# EAGLE design pmon_20v (EAGLE 6.5.0)
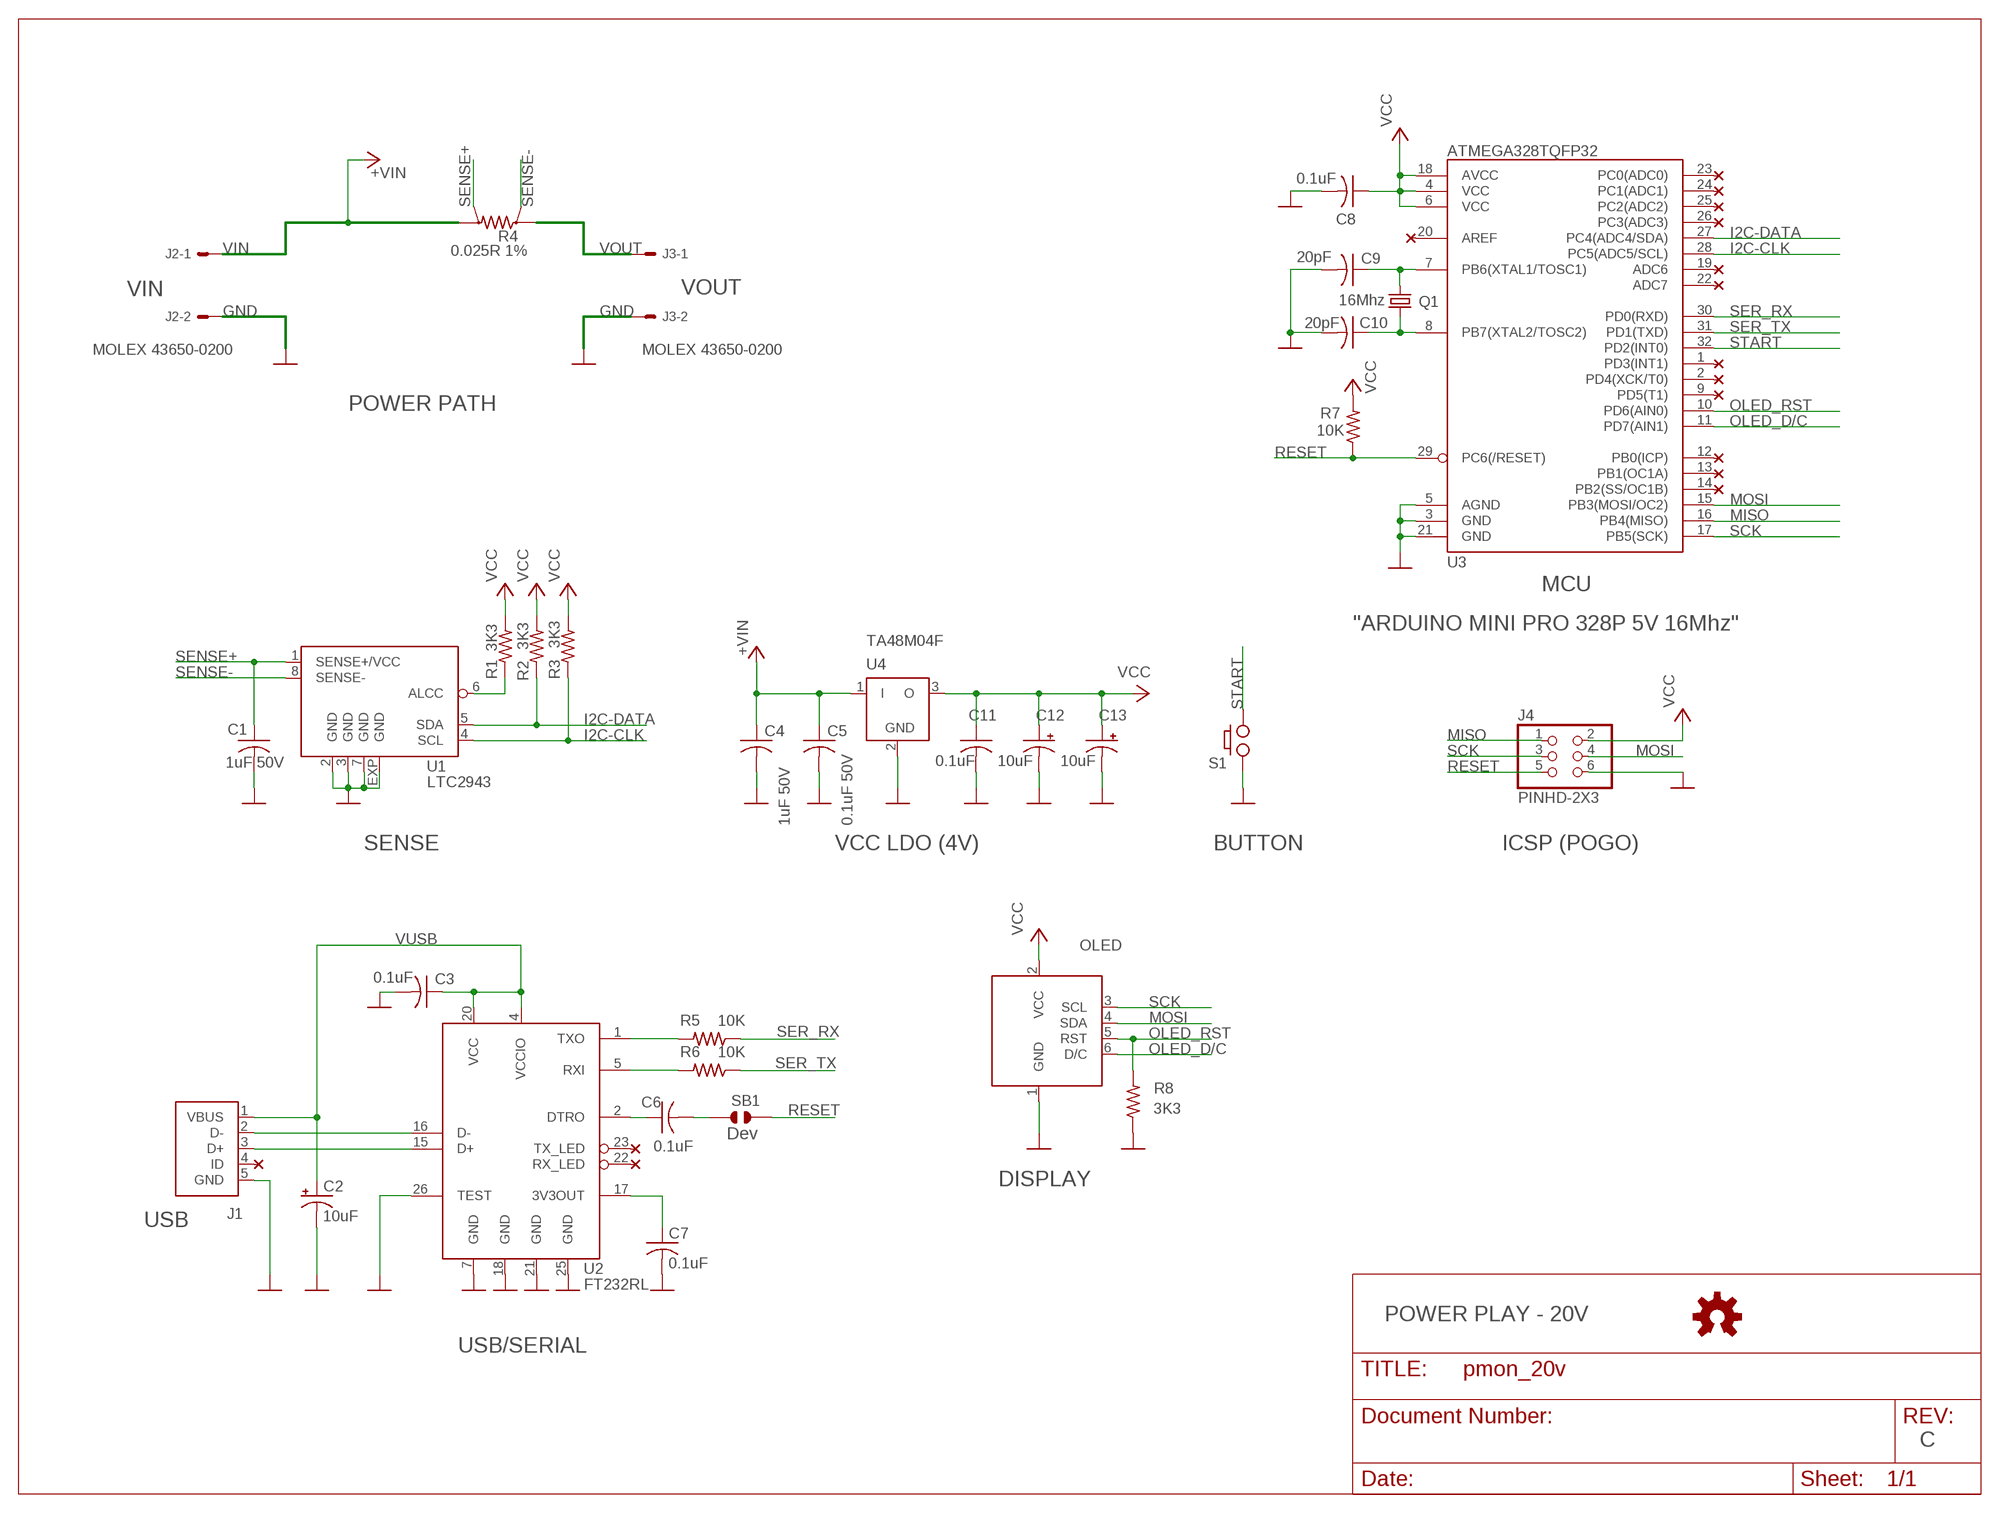
[diagram p0: schematic, sheet 1]

## Parts
C1  1uF 50V  CAP-C0603  [C0603]
C2  10uF  CPOL-USA/3216-18R  [A/3216-18R]
C3  0.1uF  CAP-C0603  [C0603]
C4  1uF 50V  CAP-C0603  [C0603]
C5  0.1uF 50V  CAP-C0603  [C0603]
C6  0.1uF  CAP-C0603  [C0603]
C7  0.1uF  CAP-C0603  [C0603]
C8  0.1uF  CAP-C0603  [C0603]
C9  20pF  CAP-C0603  [C0603]
C10  20pF  CAP-C0603  [C0603]
C11  0.1uF  CAP-C0603  [C0603]
C12  10uF  CPOL-USA/3216-18R  [A/3216-18R]
C13  10uF  CPOL-USA/3216-18R  [A/3216-18R]
J1  USB  [USB-MICRO-ZX62RD-AB-5P8]
J2  MOLEX 43650-0200  POWER_CON27-2021  [POWER_CON]
J3  MOLEX 43650-0200  POWER_CON27-2021  [POWER_CON]
J4  PINHD-2X3  [2X03]
OLED  OLED  [OLED]
Q1  16Mhz  CRYSTALCTS406  [CRYSTAL-CTS406]
R1  3K3  RES-R0603  [R0603]
R2  3K3  RES-R0603  [R0603]
R3  3K3  RES-R0603  [R0603]
R4  0.025R 1%  RES-SHUNT-6432  [KELVIN-6432]
R5  10K  RES-R0603  [R0603]
R6  10K  RES-R0603  [R0603]
R7  10K  RES-R0603  [R0603]
R8  3K3  RES-R0603  [R0603]
S1  PUSH_BUTTON  [TLE1105]
SB1  JUMPER_SOLDER_1X2  [JUMPER_SOLDER_1X2]
U1  LTC2943  [DFN8-3X3]
U2  FT232RL  [SSOP28DB]
U3  ATMEGA328TQFP32  [TQFP32-08]
U4  TA48M04F  LP2950  [DPACK]
U$28  OSH  [OSH]

## Nets
GND: C1.2 C2.- C3.2 C4.2 C5.2 C7.2 C8.2 C9.2 C10.2 C11.2 C12.- C13.- J1.5(GND) J2.2 J3.2 J4.6 OLED.1(GND) R8.1 S1.A U1.2(GND) U1.3(GND) U1.7(GND) U1.EXP(GND) U2.7(GND) U2.18(GND) U2.21(GND) U2.25(GND) U2.26(TEST) U3.3(GND) U3.5(AGND) U3.21(GND) U4.2(GND)
I2C-CLK: R3.1 U1.4(SCL) U3.28(PC5(ADC5/SCL))
I2C-DATA: R2.1 U1.5(SDA) U3.27(PC4(ADC4/SDA))
MISO: J4.1 U3.16(PB4(MISO))
MOSI: J4.4 OLED.4(SDA) U3.15(PB3(MOSI/OC2))
N$1: R1.1 U1.6(ALCC)
N$2: C9.1 Q1.1 U3.7(PB6(XTAL1/TOSC1))
N$6: R5.2 U2.1(TXO)
N$7: C10.1 Q1.3 U3.8(PB7(XTAL2/TOSC2))
N$8: R6.2 U2.5(RXI)
N$10: J1.3(D+) U2.15(D+)
N$11: C6.1 U2.2(DTRO)
N$12: C6.2 SB1.1
N$15: J1.2(D-) U2.16(D-)
N$16: C7.1 U2.17(3V3OUT)
OLED_D/C: OLED.6(D/C) U3.11(PD7(AIN1))
OLED_RST: OLED.5(RST) R8.2 U3.10(PD6(AIN0))
RESET: J4.5 R7.1 SB1.2 U3.29(PC6(/RESET))
SCK: J4.3 OLED.3(SCL) U3.17(PB5(SCK))
SENSE+: C1.1 R4.V2 U1.1(SENSE+/VCC)
SENSE-: R4.V1 U1.8(SENSE-)
SER_RX: R5.1 U3.30(PD0(RXD))
SER_TX: R6.1 U3.31(PD1(TXD))
START: S1.B U3.32(PD2(INT0))
VCC: C8.1 C11.1 C12.+ C13.+ J4.2 OLED.2(VCC) R1.2 R2.2 R3.2 R7.2 U3.4(VCC) U3.6(VCC) U3.18(AVCC) U4.3(O)
VIN: C4.1 C5.1 J2.1 R4.I2 U4.1(I) ; supply symbol labelled +VIN
VOUT: J3.1 R4.I1
VUSB: C2.+ C3.1 J1.1(VBUS) U2.4(VCCIO) U2.20(VCC)
Unconnected: J1.4(ID) U2.22(RX_LED) U2.23(TX_LED) U3.1(PD3(INT1)) U3.2(PD4(XCK/T0)) U3.9(PD5(T1)) U3.12(PB0(ICP)) U3.13(PB1(OC1A)) U3.14(PB2(SS/OC1B)) U3.19(ADC6) U3.20(AREF) U3.22(ADC7) U3.23(PC0(ADC0)) U3.24(PC1(ADC1)) U3.25(PC2(ADC2)) U3.26(PC3(ADC3))

## Notes on the sheet
- VIN | VOUT
- POWER PATH
- MCU
- "ARDUINO MINI PRO 328P 5V 16Mhz"
- SENSE | VCC LDO (4V) | BUTTON | ICSP (POGO)
- Dev
- DISPLAY
- USB
- POWER PLAY - 20V
- USB/SERIAL
- C

## Library data of the parts
C1 C3-C11 = pmon_20v:CAP-: CAPACITOR, American symbol
C2 C12 C13 = pmon_20v:CPOL-US
J1 = pmon_20v:USB
J2 J3 = pmon_20v:POWER_CON: CONNECTOR wire to board 2.54 mm (.1 inch) pitch header; OC_FARNELL: unknown; OC_NEWARK: unknown
J4 = pmon_20v:PINHD-2X3
OLED = pmon_20v:OLED
Q1 = pmon_20v:CRYSTAL: CRYSTAL; OC_FARNELL: unknown; OC_NEWARK: unknown
R1-R3 R5-R8 = pmon_20v:RES-: RESISTOR, American symbol
R4 = pmon_20v:RES-SHUNT-: SMD SHUNT RESISTOR
S1 = pmon_20v:PUSH_BUTTON
SB1 = pmon_20v:JUMPER_SOLDER_1X2
U1 = pmon_20v:LTC2943
U2 = pmon_20v:FT232RL
U3 = pmon_20v:ATMEGA328
U4 = linear:LP2950: 100 mA, Low Power Low Dropout Voltage Regulator Source: http://www.onsemi.com/pub/Collateral/LP2950-D.PDF
U$28 = pmon_20v:OSH

## Net classes
1 power: width 0.254 mm

## Board
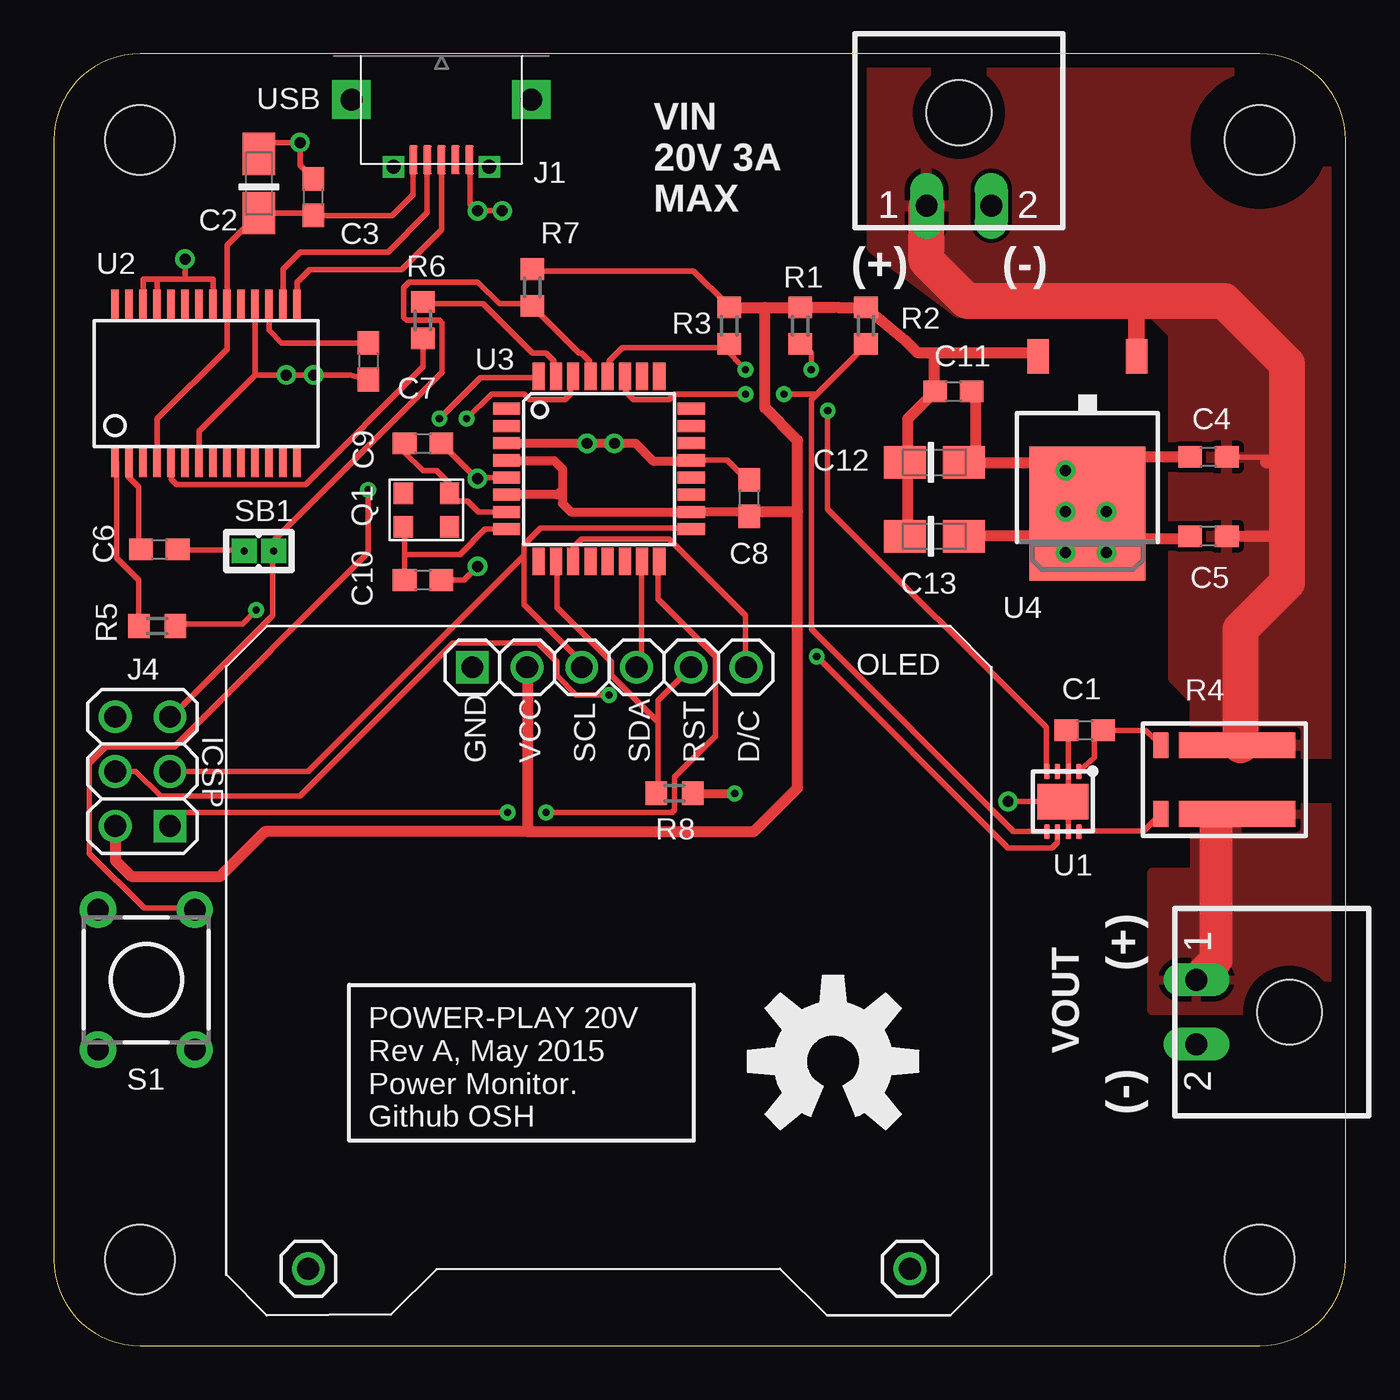
[diagram p1: board, top side]
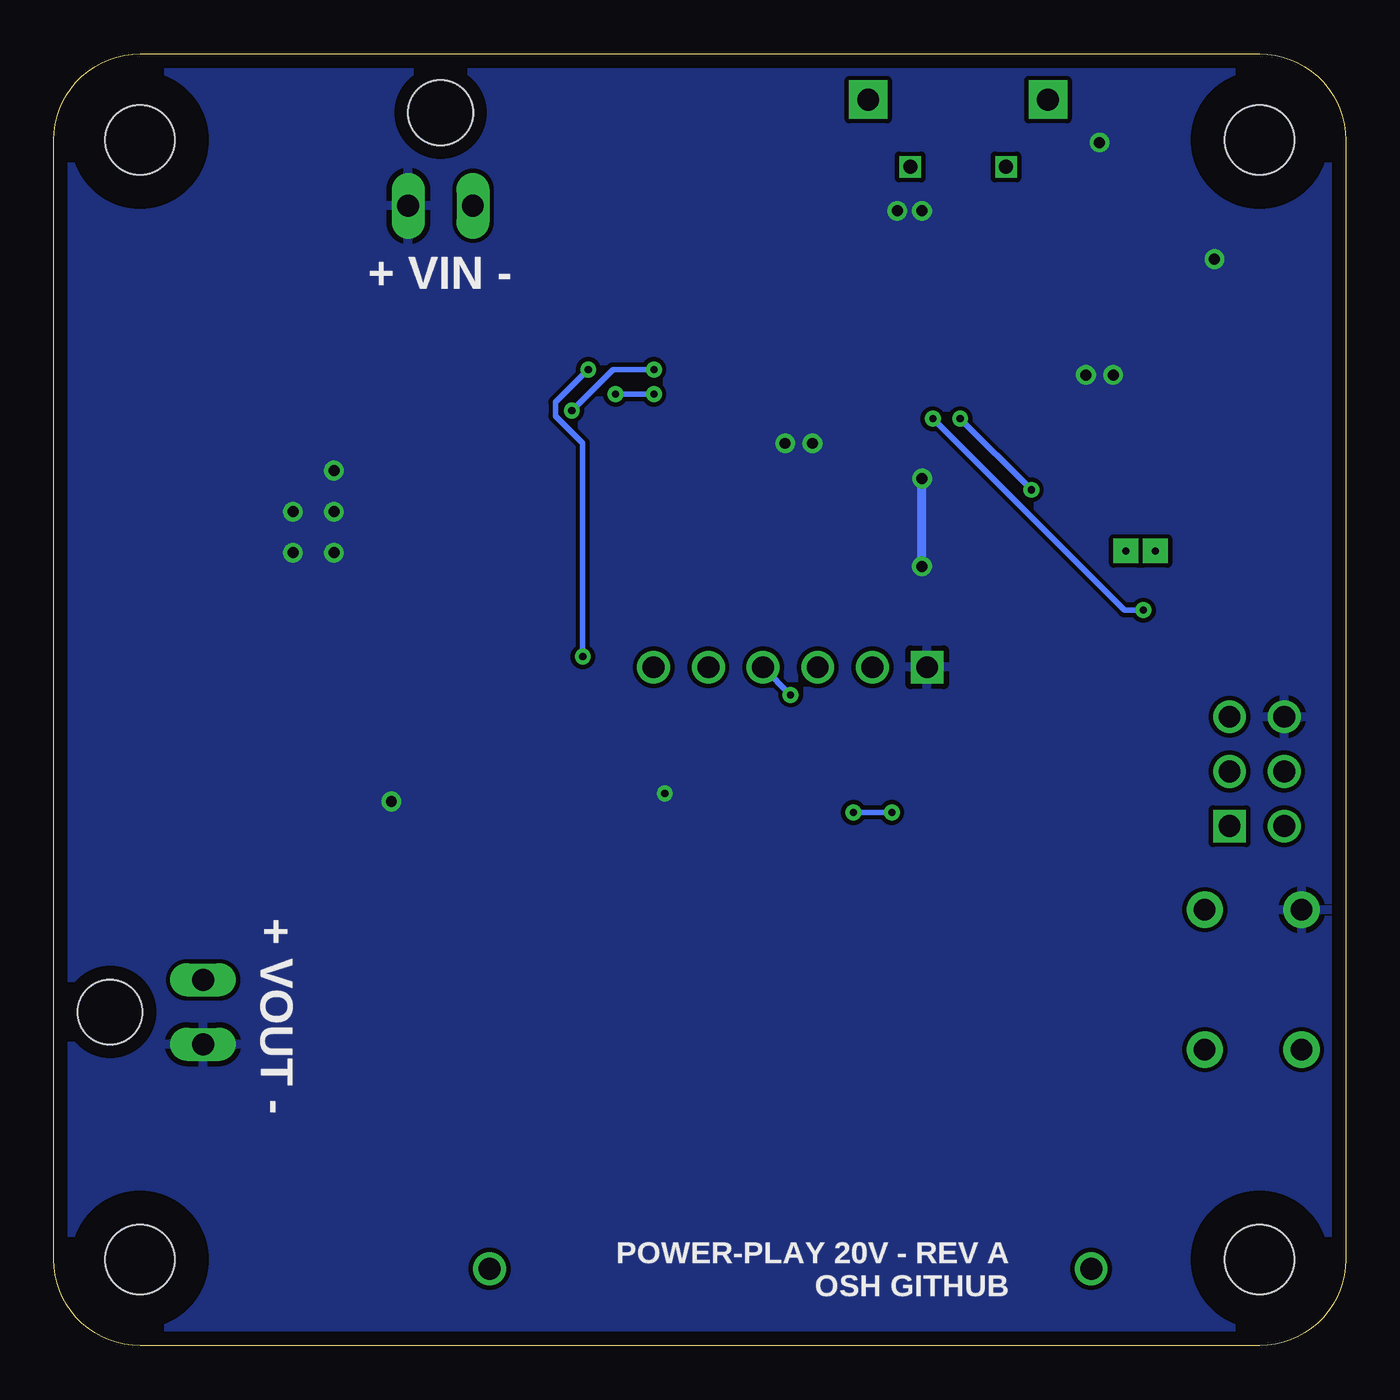
[diagram p2: board, bottom side, seen from below]

Size 60 x 60 mm. Coordinates in mm from the lower left corner, seen from the top.
Outline: 4,0 56,0 arc90 60,4 60,56 arc90 56,60 4,60 arc90 0,56 0,4 arc90 4,0
Copper layers (1*16): Top 0.035mm / dielectric 1.5mm / Bottom 0.035mm
Design rules "default *": minimum track width 10mil, minimum drill 13mil, track to track 8mil, track to pad 8mil, pad to pad 8mil, via to via 8mil, smd to smd 0mil, copper to edge 25mil, drill to drill 8mil, minimum pad ring 7mil, minimum via ring 8mil, stop-mask expansion 4mil, vias tented up to drill 20mil, thermal gap 10mil
Holes 3.2 mm at 4,4 56,4 4,56 56,56
tKeepout: area 1,53 to 7,59
tRestrict: area 53,1 to 59,7; area 1,1 to 7,7; area 53,53 to 59,59; area 1,53 to 7,59
bRestrict: area 1,53 to 7,59; area 1,1 to 7,7; area 53,53 to 59,59; area 53,1 to 59,7

### Footprints (pad centres in the part's own frame; a part is rotated, then mirrored left to right if it is on the bottom)
C0603 = smd 1.1 x 1: 1 -0.85,0; 2 0.85,0
A/3216-18R = smd 1.95 x 1.5: + 1.375,0; - -1.375,0
USB-MICRO-ZX62RD-AB-5P8 = smd 0.4 x 1.35: 1 1.3,5.425; 2 0.65,5.425; 3 0,5.425; 4 -0.65,5.425; 5 -1.3,5.425 | drill 1.016 pad 1.778 square: A -4.175,2.625; D 4.175,2.625 | drill 0.65 pad 0.914 square: B -2.225,5.75; C 2.225,5.75
POWER_CON = drill 1.016 long: 1 1.5,0; 2 -1.5,0 | hole 3: 0,-4.32
2X03 = drill 1.016 square: 1 -2.54,-1.27 | drill 1.016: 2 -2.54,1.27; 3 0,-1.27; 4 0,1.27; 5 2.54,-1.27; 6 2.54,1.27
OLED = drill 1.016 square: 1 0,0 | drill 1.016: 2 2.54,0; 3 5.08,0; 4 7.62,0; 5 10.16,0; 6 12.7,0; 7 20.32,-27.94; 8 -7.62,-27.94
CRYSTAL-CTS406 = smd 0.9 x 1: 1 -1.075,-0.775; 2 1.075,-0.775; 3 1.075,0.775; 4 -1.075,0.775
R0603 = smd 1 x 1.1: 1 -0.85,0; 2 0.85,0
KELVIN-6432 = smd 1.2 x 5.4: I1 -1.6,2.7; I2 1.6,2.7 | smd 1.2 x 0.7: V1 -1.6,6.25; V2 1.6,6.25
TLE1105 = drill 1 pad 1.676: A -2.25,3.25; AX -2.25,-3.25; B 2.25,3.25; BX 2.25,-3.25
JUMPER_SOLDER_1X2 = drill 0.33 pad 1.143 square: 1 -0.686,0; 2 0.686,0
DFN8-3X3 = smd 0.25 x 0.7: 1 -0.75,-1.4; 2 -0.25,-1.4; 3 0.25,-1.4; 4 0.75,-1.4; 5 0.75,1.4; 6 0.25,1.4; 7 -0.25,1.4; 8 -0.75,1.4 | smd 2.38 x 1.65: EXP 0,0
SSOP28DB = smd 0.348 x 1.397: 1 -4.225,-3.656; 2 -3.575,-3.656; 3 -2.925,-3.656; 4 -2.275,-3.656; 5 -1.625,-3.656; 6 -0.975,-3.656; 7 -0.325,-3.656; 8 0.325,-3.656; 9 0.975,-3.656; 10 1.625,-3.656; 11 2.275,-3.656; 12 2.925,-3.656; 13 3.575,-3.656; 14 4.225,-3.656; 15 4.225,3.656; 16 3.575,3.656; 17 2.925,3.656; 18 2.275,3.656; 19 1.625,3.656; 20 0.975,3.656; 21 0.325,3.656; 22 -0.325,3.656; 23 -0.975,3.656; 24 -1.625,3.656; 25 -2.275,3.656; 26 -2.925,3.656; 27 -3.575,3.656; 28 -4.225,3.656
TQFP32-08 = smd 1.27 x 0.559: 1 -4.293,2.8; 2 -4.293,2; 3 -4.293,1.2; 4 -4.293,0.4; 5 -4.293,-0.4; 6 -4.293,-1.2; 7 -4.293,-2; 8 -4.293,-2.8; 17 4.293,-2.8; 18 4.293,-2; 19 4.293,-1.2; 20 4.293,-0.4; 21 4.293,0.4; 22 4.293,1.2; 23 4.293,2; 24 4.293,2.8 | smd 0.559 x 1.27: 9 -2.8,-4.293; 10 -2,-4.293; 11 -1.2,-4.293; 12 -0.4,-4.293; 13 0.4,-4.293; 14 1.2,-4.293; 15 2,-4.293; 16 2.8,-4.293; 25 2.8,4.293; 26 2,4.293; 27 1.2,4.293; 28 0.4,4.293; 29 -0.4,4.293; 30 -1.2,4.293; 31 -2,4.293; 32 -2.8,4.293
DPACK = smd 1 x 1.6: 1 -2.28,-4.8; 3 2.28,-4.8 | smd 5.4 x 6.2: 2 0,2.5

### Placement (x,y rotation side)
C1  47.88,28.57 180 top
C2  9.53,53.98 270 top
C3  12.06,53.34 90 top
C4  53.63,41.27 180 top
C5  53.63,37.59 180 top
C6  4.9,36.98 0 top
C7  14.61,45.72 270 top
C8  32.31,39.37 90 top
C9  17.14,41.91 0 top
C10  17.14,35.56 0 top
C11  41.78,44.32 0 top
C12  40.89,41.02 180 top
C13  40.89,37.59 180 top
J1  18,60.5 180 top
J2  42.04,52.94 180 top
J3  53.07,15.49 90 top
J4  4.12,26.67 90 top
OLED  19.44,31.51 0 top
Q1  17.3,38.81 180 top
R1  34.67,47.37 90 top
R2  37.72,47.37 90 top
R3  31.37,47.37 90 top
R4  57.66,26.29 90 top
R5  4.8,33.43 180 top
R6  17.14,47.62 270 top
R7  22.23,49.15 90 top
R8  28.83,25.65 180 top
S1  4.3,17 0 top
SB1  9.53,36.91 0 top
U1  46.86,25.27 180 top
U2  7.07,44.69 0 top
U3  25.32,40.72 0 top
U4  48.01,41.15 180 top
U$28  36.2,13.21 0 top

### Tracks (layer width: path | path; a pad name or v marks a point on that pad's centre or on a via)
GND  (via drill 0.33, 0.51)
  Top 0.203: U1.2 47.12,26.62 | 47.12,25.88 46.86,25.63 | U1.7 47.12,23.93 | 47.12,24.66 46.86,24.92 U1.EXP | 47.12,28.57 C1.2
  Top 0.254: C1.2 46.86,28.32 46.74,28.31 | C10.2 19.05,35.56 v19.68,36.2 | U3.5 19.73,40.32 v19.68,40.27 19.64,40.27 C9.2 | U3.3 21.02,41.91 | 29.56,41.07 U3.21 31.27,41.12 32.17,40.22 C8.2 | C2.- 9.53,55.88 v11.43,55.88 11.43,54.83 C3.2 | J1.5 19.33,55.05 19.33,53.01 19.63,52.7 v19.68,52.7 v20.83,52.7 | C7.2 13.76,45.09 v12.06,45.09 v10.79,45.09 9.34,45.09 | 9.34,45.09 U2.18 | U2.7 6.74,42.48 9.34,45.09 | 47.12,26.62 47.12,25.88 | 46.86,25.63 U1.EXP v44.32,25.27 | 47.12,23.93 47.12,24.66 | U1.3 46.74,26.67 U1.2 47.12,26.8 | U1.7 | 4.83,48.35 U2.25 4.79,49.53 | 47.12,26.8 47.12,28.57 | U4.2 48.01,40.64 v46.99,40.64 | 46.86,37.59 46.86,38.73 v46.99,38.73 | 49.66,37.47 49.66,39.37 49.53,39.37 49.53,38.73 v48.9,38.73 | 47.12,26.8 U1.2 | C5.2 52.83,37.59 52.78,37.47 | U2.26 4.14,49.53 4.79,49.53 | U2.21 7.39,49.53 6.35,49.53 6.1,49.53 | 6.1,49.53 4.79,49.53 | v6.1,50.47 6.1,49.53
  Top 0.406: 21.02,41.91 v24.77,41.91 v26.04,41.91 27.03,41.91 27.86,41.07 29.56,41.07 | R8.1 v31.62,25.65 | v46.99,40.64 46.1,41.02 | C13.- 42.52,37.47 | 46.23,37.47 46.35,37.59 46.86,37.59 | C11.2 42.8,44.16
  Top 0.508: 46.23,37.47 46.1,37.59 C13.- | C12.- 42.8,41.02 | 42.8,41.02 46.1,41.02 | 42.8,44.16 42.8,41.02 | 52.78,37.47 49.66,37.47 | C4.2 48.9,41.27 v48.9,38.73
  Bottom 0.254: 19.56,31.62 OLED.1
  Bottom 0.406: v19.68,36.2 v19.68,40.27
  Bottom 0.508: 19.68,31.75 19.56,31.62 19.48,31.55
  other vias: 46.99,36.83 48.9,36.83
  pour Bottom: 0,60 60,60 60,0 0,0
I2C-CLK  (via drill 0.33)
  Top 0.254: 25.78,44.96 U3.28 25.78,45.09 25.78,45.72 26.42,46.35 31.11,46.35 | 31.37,46.48 R3.1 | 31.11,46.35 31.37,46.35 R3.1 | v35.94,43.43 35.94,38.86 46.1,28.7 46.1,26.8 U1.4 | 31.11,46.35 v32.13,45.34 | 31.11,46.35 R3.1
  Bottom 0.254: v35.94,43.43 34.04,45.34 v32.13,45.34
I2C-DATA  (via drill 0.33)
  Top 0.254: U1.5 44.58,23.88 35.18,33.27 35.18,43.94 35.37,44.13 | U3.27 26.54,44.96 26.54,44.32 26.92,43.94 28.57,43.94 28.83,44.2 v32.13,44.2 | 35.37,44.13 37.72,46.48 R2.1 | v33.91,44.2 35.31,44.2 35.37,44.13
  Bottom 0.254: v33.91,44.2 v32.13,44.2
MISO  (via drill 0.33)
  Top 0.254: 28.07,36.32 U3.16 28.07,36.2 28.07,34.67 30.73,32 30.73,28.32 28.83,26.42 28.83,24.89 28.7,24.77 v22.86,24.77 | v21.08,24.77 6.1,24.77 5.46,24.13 J4.1
  Bottom 0.254: v21.08,24.77 v22.86,24.77
MOSI  (via drill 0.33)
  Top 0.254: U3.15 27.3,36.32 27.3,31.75 27.18,31.62 OLED.4 | J4.4 3.81,26.67 4.95,25.53 11.43,25.53 18.54,32.64 22.48,32.64 23.37,31.75 23.37,31.11 24.26,30.23 v25.78,30.23
  Bottom 0.254: v25.78,30.23 27.05,31.5 OLED.4
N$1  (via drill 0.33)
  Top 0.254: U1.6 46.61,23.75 46.61,23.37 46.35,23.11 44.32,23.11 v35.43,32 | 34.92,46.35 34.8,46.48 R1.1 34.92,46.35 | v35.18,45.34 35.18,46.1 34.92,46.35
  Bottom 0.254: v35.43,32 35.43,41.91 36.7,43.18 36.7,43.81 v35.18,45.34
N$2
  Top 0.254: U3.7 19.73,38.72 19.23,39.22 18.75,39.22 Q1.1 18.38,40.04 17.78,40.64 17.14,40.64 16.3,41.49 C9.1
N$6
  Top 0.254: R5.2 3.94,33.53 3.94,35.56 2.92,36.58 2.92,41.02 U2.1
N$7
  Top 0.254: Q1.3 16.3,38.04 16.3,36.83 | 16.3,36.83 C10.1 | U3.8 20.04,37.92 18.87,36.75 16.37,36.75 16.3,36.83
N$8
  Top 0.254: R6.2 17.14,45.47 11.68,40.01 5.71,40.01 5.46,40.26 5.46,41.02 U2.5
N$10
  Top 0.254: J1.3 18.01,55.07 18.01,51.84 16.15,49.99 11.89,49.99 11.29,49.39 U2.15
N$11
  Top 0.254: 3.43,41.02 U2.2 3.43,40.89 3.43,40.39 3.94,39.88 3.94,37.08 C6.1
N$12
  Top 0.254: C6.2 5.84,36.96 8.76,36.96 SB1.1
N$15
  Top 0.254: J1.2 17.35,52.63 15.52,50.8 11.43,50.8 10.64,50.01 U2.16
N$16
  Top 0.254: U2.17 9.99,47.16 10.58,46.57 C7.1
OLED_D/C
  Top 0.254: 32.13,31.62 OLED.6 32.13,31.75 32.13,33.91 28.57,37.47 24.51,37.47 24.13,37.08 24.13,36.45 U3.11
OLED_RST
  Top 0.254: 23.37,36.32 U3.10 23.37,36.2 23.37,34.29 25.91,31.75 25.91,31.11 28.07,28.96 | 28.07,28.96 28.07,29.97 29.59,31.5 OLED.5 | 28.07,28.96 28.07,25.65 R8.2
RESET
  Top 0.254: J4.5 5.46,29.21 10.16,33.91 10.16,36.83 SB1.2 10.29,36.96 10.29,37.47 18.03,45.21 18.03,47.5 17.91,47.62 16.38,47.62 16.26,47.75 16.26,49.15 16.51,49.4 19.68,49.4 20.7,48.39 22.23,48.39 R7.1 22.23,48.26 24.38,46.1 24.51,46.1 24.89,45.72 24.89,45.09 U3.29
SCK
  Top 0.254: 29.72,37.85 U3.17 | 29.59,37.97 U3.17 | 24.51,31.62 OLED.3 24.51,31.75 21.84,34.42 21.84,36.7 | 21.84,36.7 21.84,37.21 22.61,37.97 29.46,37.97 U3.17 | J4.3 11.81,26.67 21.84,36.7
SENSE+
  Top 0.254: U1.1 48.32,27.33 48.32,28.16 C1.1 50.72,28.57 R4.V2
SENSE-
  Top 0.203: U1.8 47.62,23.91
  Top 0.254: 47.62,23.91 50.63,23.91 R4.V1
SER_RX  (via drill 0.33)
  Top 0.254: v9.4,34.16 8.76,33.53 5.71,33.53 R5.1 | v19.18,43.05 20.32,44.2 21.84,44.2 22.1,43.94 23.75,43.94 24,44.2 24,44.96 U3.30
  Bottom 0.254: v9.4,34.16 10.29,34.16 v19.18,43.05
SER_TX
  Top 0.254: R6.1 17.14,48.39 19.94,48.39 22.23,46.1 22.86,46.1 23.24,45.72 23.24,45.09 U3.31
START  (via drill 0.33)
  Top 0.254: v17.91,43.05 19.81,44.96 22.48,44.96 U3.32 | v14.61,39.75 14.61,36.83 5.59,27.81 2.41,27.81 1.65,27.05 1.65,22.86 4.19,20.32 6.48,20.32 S1.B
  Bottom 0.254: v14.61,39.75 v17.91,43.05
VCC
  Top 0.254: U3.4 21.05,41.1 | 32.31,38.66 32.38,38.73 32.38,38.61 C8.1 | 36.45,48.26 36.32,48.13 | 22.23,50.04 R7.2 22.23,49.91 29.72,49.91 31.24,48.39 R3.2 | 36.45,48.26 36.45,48.22 | 36.45,48.26 36.23,48.22 | OLED.2 22.1,31.5 22,31.49 | 29.72,38.73 U3.18 | 39.5,41.02 C12.+ 39.65,41.02
  Top 0.406: R3.2 31.5,48.35 | 21.05,41.1 23.24,41.1 23.62,40.72 23.62,39.75 | 23.62,39.75 23.39,39.52 U3.6 | 23.62,39.75 23.62,39.12 24.02,38.72 U3.18 | 29.63,38.73 29.72,38.73 32.38,38.73 | C11.1 40.89,44.36
  Top 0.508: 22,31.49 22,23.88 | J4.2 2.85,22.55 3.6,21.8 7.74,21.8 9.81,23.88 22,23.88 | R3.2 33.02,48.22 | 33.02,48.22 R1.2 36.23,48.22 | 36.41,48.22 36.45,48.22 R2.2 39.54,46.7 40.13,46.1 41,46.1 | 22,23.88 32.51,23.88 34.54,25.91 34.54,38.73 | 34.54,38.73 34.54,42.04 33.02,43.56 33.02,48.22 | 32.38,38.73 34.54,38.73 | U4.3 45.57,46.1 41,46.1 | C11.1 39.65,43.04 39.65,41.02 39.65,37.72 C13.+ | 40.89,44.36 40.89,45.99 41,46.1
VIN
  Top 0.254: C4.1 56.52,41.27 57.28,41.02
  Top 0.508: 56.27,41.02 57.28,41.02 | C5.1 57.28,37.59
  Top 0.762: U4.1 50.29,48.51
  Top 1.27: R4.I2 55.12,27.89
  Top 1.676: 55.12,27.89 55.12,33.27 57.28,35.43 57.28,37.59 57.28,41.02 57.28,45.59 54.36,48.51 50.29,48.51 42.42,48.51 40.54,50.4 J2.1
  pour Top: 38,61 38,51 42,48 51,48 52,47 52,31 53,30 53,27.52 63,27.52 62.78,52.84 62.95,61
VOUT
  Top 0.406: R4.I1 54.15,24.69 53.85,24.38 53.98,24.26
  Top 1.524: 53.98,24.26 53.98,17.9 J3.1
  pour Top: 53,25 63,25 63,15.56 51,15.56 51,22 53,22
VUSB
  Top 0.254: J1.1 16.69,55.06 16.69,53.47 15.71,52.49 C3.1 11.96,52.6 C2.+ 8.04,51.12 U2.20 8.04,46.29 4.8,43.05 4.8,41.05 U2.4

### Text on the board
tPlace: USB | VIN / 20V 3A / MAX | (+) | (-) | ICSP | (+) | VOUT | (-) | POWER-PLAY 20V / Rev A, May 2015 / Power Monitor. / Github OSH
bPlace: + VIN - | + VOUT - | POWER-PLAY 20V - REV A / OSH GITHUB